# EAGLE schematic Test Board (EAGLE 6.5.0)
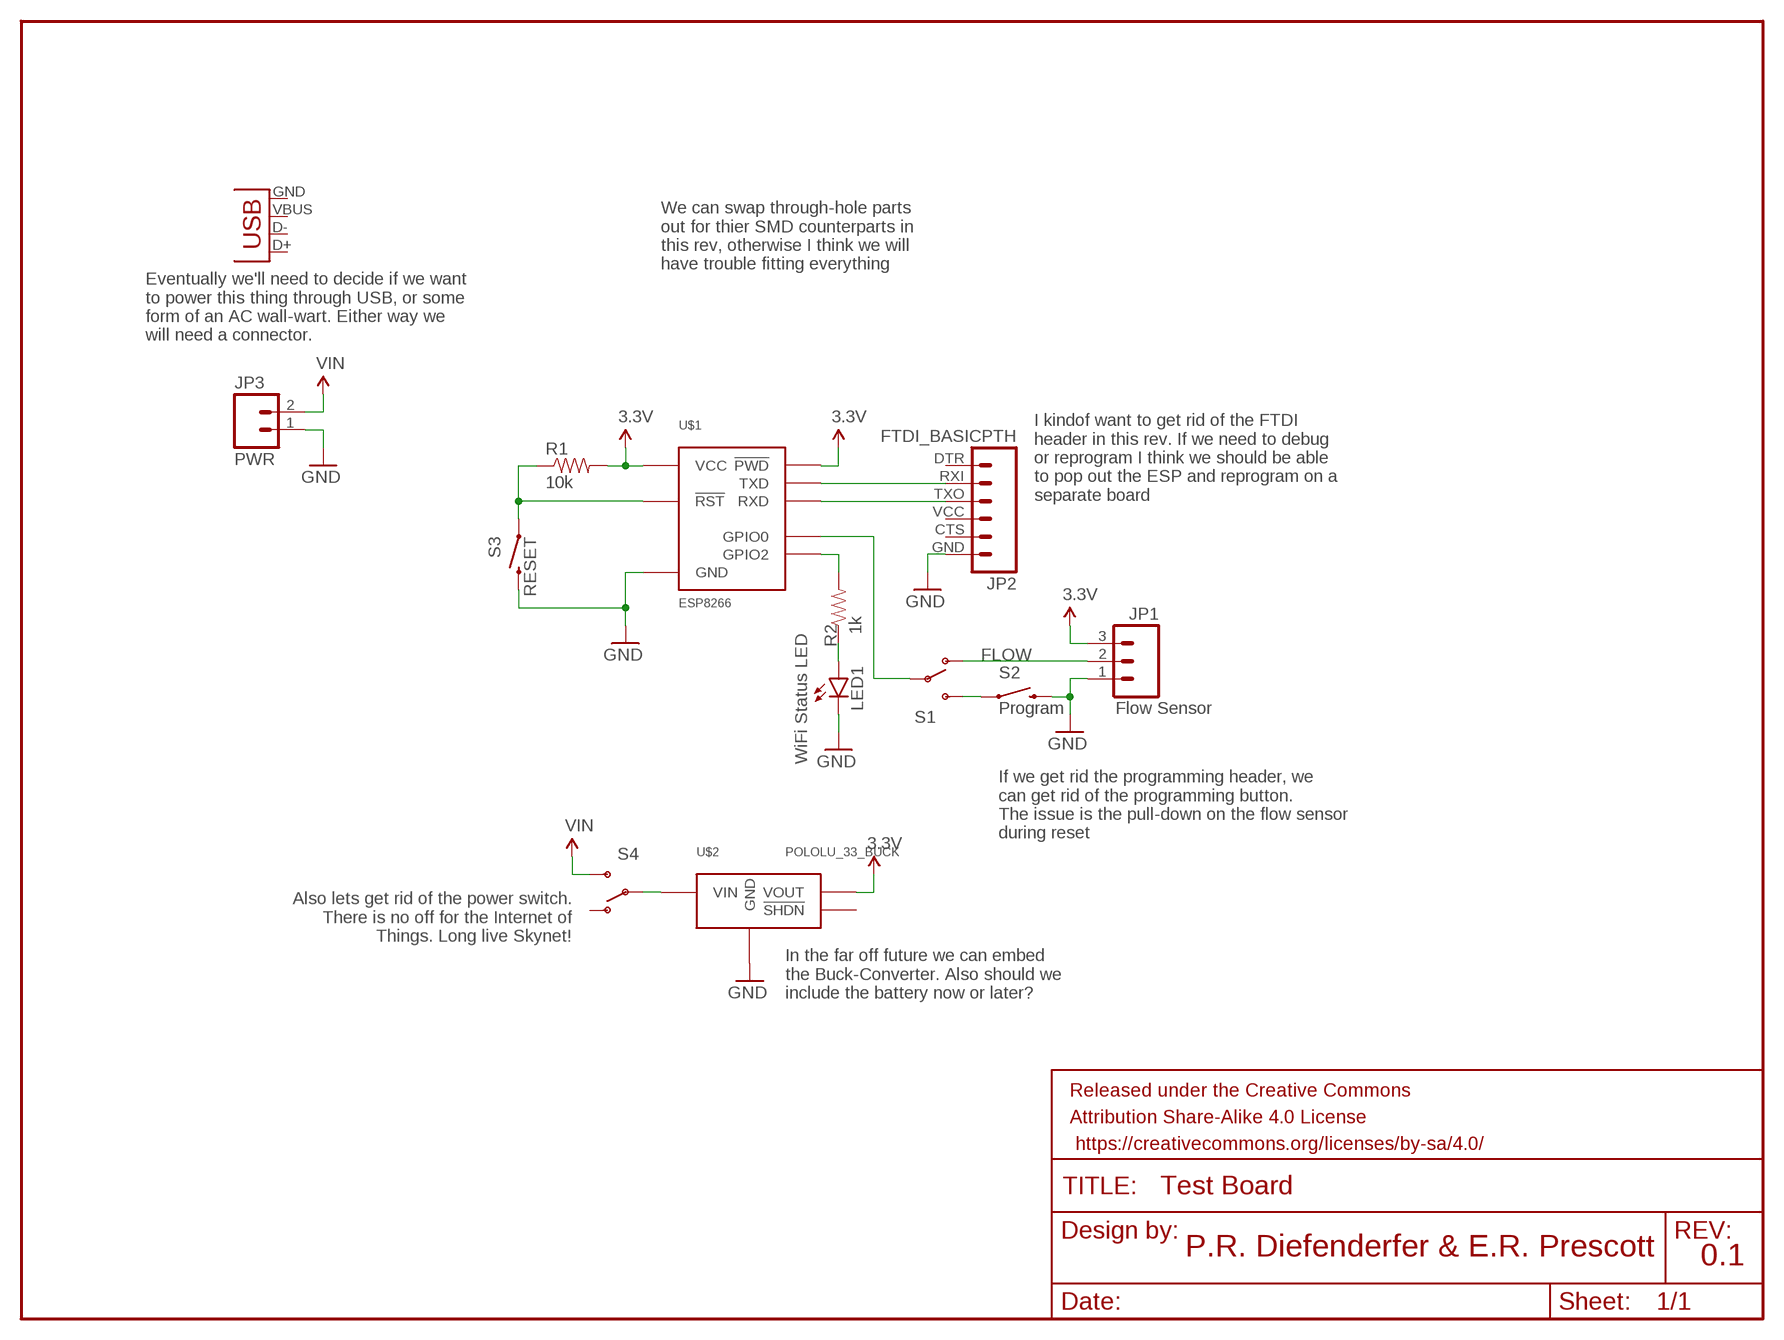
[diagram p0: schematic, sheet 1]

## Parts
FRAME1  FRAME-LETTER  [CREATIVE_COMMONS]
JP1  Flow Sensor  M03LOCK  [1X03_LOCK]
JP2  FTDI_BASICPTH  [FTDI_BASIC]
JP3  PWR  M02LOCK  [1X02_LOCK]
JP4  USBSMD  [USB-MINIB]
LED1  WiFi Status LED  LED-3MM-NO_SILK  [LED3MM-NS]
R1  10k  RESISTORAXIAL-0.3  [AXIAL-0.3]
R2  1k  RESISTORAXIAL-0.3  [AXIAL-0.3]
S1  SWITCH-SPDTPTH  [SWITCH-SPDT]
S2  Program  SWITCH-MOMENTARY-2PTH  [TACTILE-PTH]
S3  RESET  SWITCH-MOMENTARY-2PTH  [TACTILE-PTH]
S4  SWITCH-SPDTPTH  [SWITCH-SPDT]
U$1  ESP8266  ESP8266_R3  [2X4_LOCK]
U$2  POLOLU_33_BUCK  [1X4_LOCK]

## Nets
3.3V: JP1.3 R1.P$2 U$1.CH_PD(!PWD) U$1.VCC U$2.VOUT
FLOW: JP1.2 S1.1(O)
GND: JP1.1 JP2.GND JP3.1 LED1.K(C) S2.3 S3.3 U$1.GND U$2.GND
N$1: S1.3(S) S2.1
N$2: JP2.RXI U$1.TXD
N$3: R1.P$1 S3.1 U$1.RST(!RST)
N$4: JP2.TXO U$1.RXD
N$5: LED1.A R2.P$1
N$6: R2.P$2 U$1.GPIO2
N$7: S1.2(P) U$1.GPIO0
N$8: S4.2(P) U$2.VIN
VIN: JP3.2 S4.3(S)
Unconnected: JP2.CTS JP2.DTR JP2.VCC JP4.D+ JP4.D- JP4.GND JP4.VBUS S4.1(O) U$2.!SHDN

## Notes on the sheet
- We can swap through-hole parts
  out for thier SMD counterparts in
  this rev, otherwise I think we will
  have trouble fitting everything
- Eventually we'll need to decide if we want
  to power this thing through USB, or some
  form of an AC wall-wart. Either way we 
  will need a connector.
- I kindof want to get rid of the FTDI
  header in this rev. If we need to debug
  or reprogram I think we should be able
  to pop out the ESP and reprogram on a
  separate board
- If we get rid the programming header, we 
  can get rid of the programming button. 
  The issue is the pull-down on the flow sensor
  during reset
- Also lets get rid of the power switch.
  There is no off for the Internet of
  Things. Long live Skynet!
- In the far off future we can embed
  the Buck-Converter. Also should we
  include the battery now or later?
- P.R. Diefenderfer & E.R. Prescott
- 0.1

## Library data of the parts
FRAME1 = SparkFun-Aesthetics:FRAME-LETTER: Schematic Frame Standard 8.5x11 US Letter frame
JP1 = SparkFun-Connectors:M03: Header 3 Standard 3-pin 0.1" header. Use with straight break away headers (SKU : PRT-00116), right angle break away headers (PRT-00553), swiss pins (PRT-00743), machine pins (PRT-00117), and female headers (PRT-00115). Molex polarized connector foot print use with SKU : PRT-08232 with associated crimp pins and housings.
JP2 = SparkFun-Connectors:FTDI_BASIC: FTDI Basic header with labels
JP3 = SparkFun-Connectors:M02: Standard 2-pin 0.1" header. Use with - straight break away headers ( PRT-00116) - right angle break away headers (PRT-00553) - swiss pins (PRT-00743) - machine pins (PRT-00117) - female headers (PRT-00115) Molex polarized connector foot print use with: PRT-08233 with associated crimp pins and housings. 2.54_SCREWTERM for use with PRT-10571. 3.5mm Screw Terminal footprints for PRT-08084 5mm Screw Terminal footprints for use with PRT-08433
JP4 = SparkFun-Connectors:USB: USB Connectors USB-B-PTH is fully proven SKU : PRT-00139/CONN-08278 USB-miniB is fully proven SKU : PRT-00587 USB-A-PCB is untested. USB-A-H is throughly reviewed, but untested. Spark Fun Electronics SKU : PRT-00437 USB-B-SMT is throughly reviewed, but untested. Needs silkscreen touching up. USB-A-S has not been used/tested USB-MB-H has not been used/tested USB-MICROB has been used. CONN-09505; PROD_ID: CONN-08193
LED1 = SparkFun-LED:LED: LEDs Standard schematic elements and footprints for 5mm, 3mm, 1206, and 0603 sized LEDs. 5mm - Spark Fun Electronics SKU : COM-00529 (and others)
R1 R2 = SparkFun-Resistors:RESISTOR: Resistor Basic schematic elements and footprints for 0603, 1206, and PTH resistors.
S1 S4 = SparkFun-Electromechanical:SWITCH-SPDT: SPDT Switch Simple slide switch, Spark Fun Electronics SKU : COM-00102 DPDT SMT slide switch, AYZ0202, SWCH-08179
S2 S3 = SparkFun-Electromechanical:SWITCH-MOMENTARY-2: Various NO switches- pushbuttons, reed, etc
U$1 = dCustom:ESP8266_R3
U$2 = dCustom:POLOLU_33_BUCK